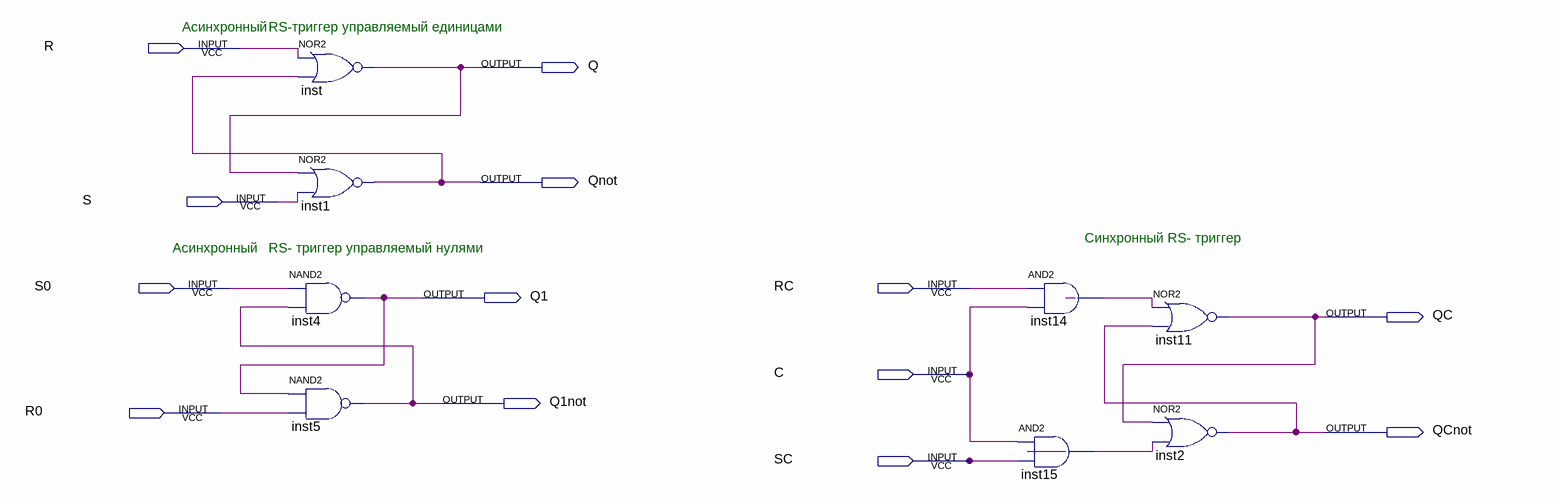
[diagram p0: schematic sheet]
// Quartus schematic RS-trigger.bdf as structural Verilog: 8 symbols, 13 pins
module \RS-trigger  (
  input  R,
  input  S,
  input  S0,
  input  RC,
  input  C,
  input  R0,
  input  SC,
  output Q,
  output Qnot,
  output Q1,
  output QC,
  output Q1not,
  output QCnot
);

  wire inst14_out, inst15_out;

  nor inst (Q, R, Qnot);
  nor inst1 (Qnot, Q, S);
  nand inst4 (Q1, S0, Q1not);
  nand inst5 (Q1not, Q1, R0);
  and inst14 (inst14_out, RC, C);
  and inst15 (inst15_out, C, SC);
  nor inst11 (QC, inst14_out, QCnot);
  nor inst2 (QCnot, QC, inst15_out);

  // Notes on the sheet:
  //   Асинхронный
  //   RS-триггер управляемый единицами
  //   Синхронный RS- триггер
  //   Асинхронный
  //   RS- триггер управляемый нулями
endmodule
